# EAGLE board Avalon (EAGLE 5.12)
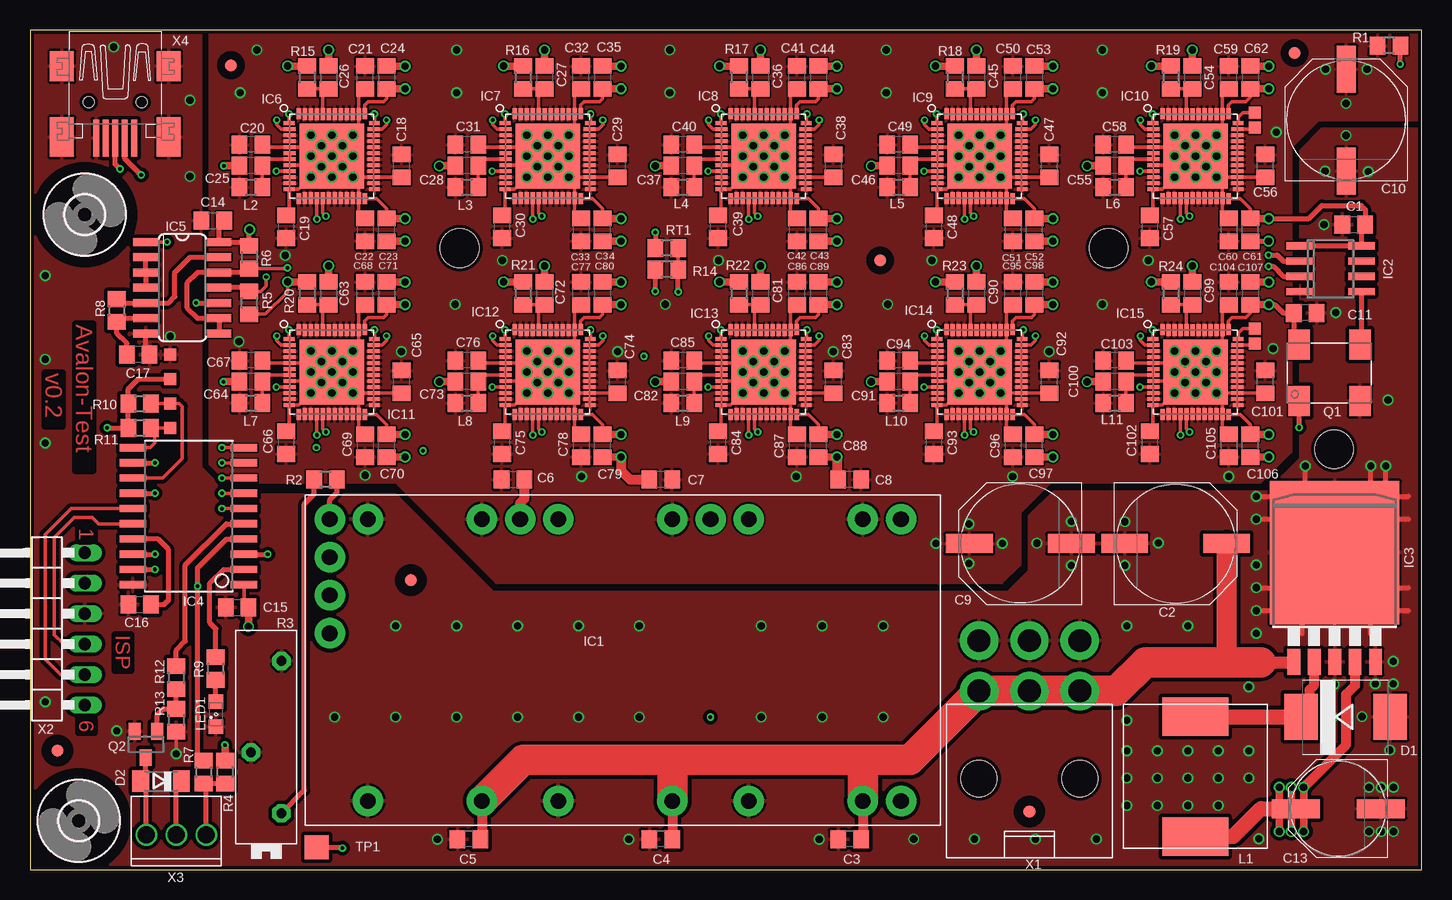
[diagram p2: board, top side]
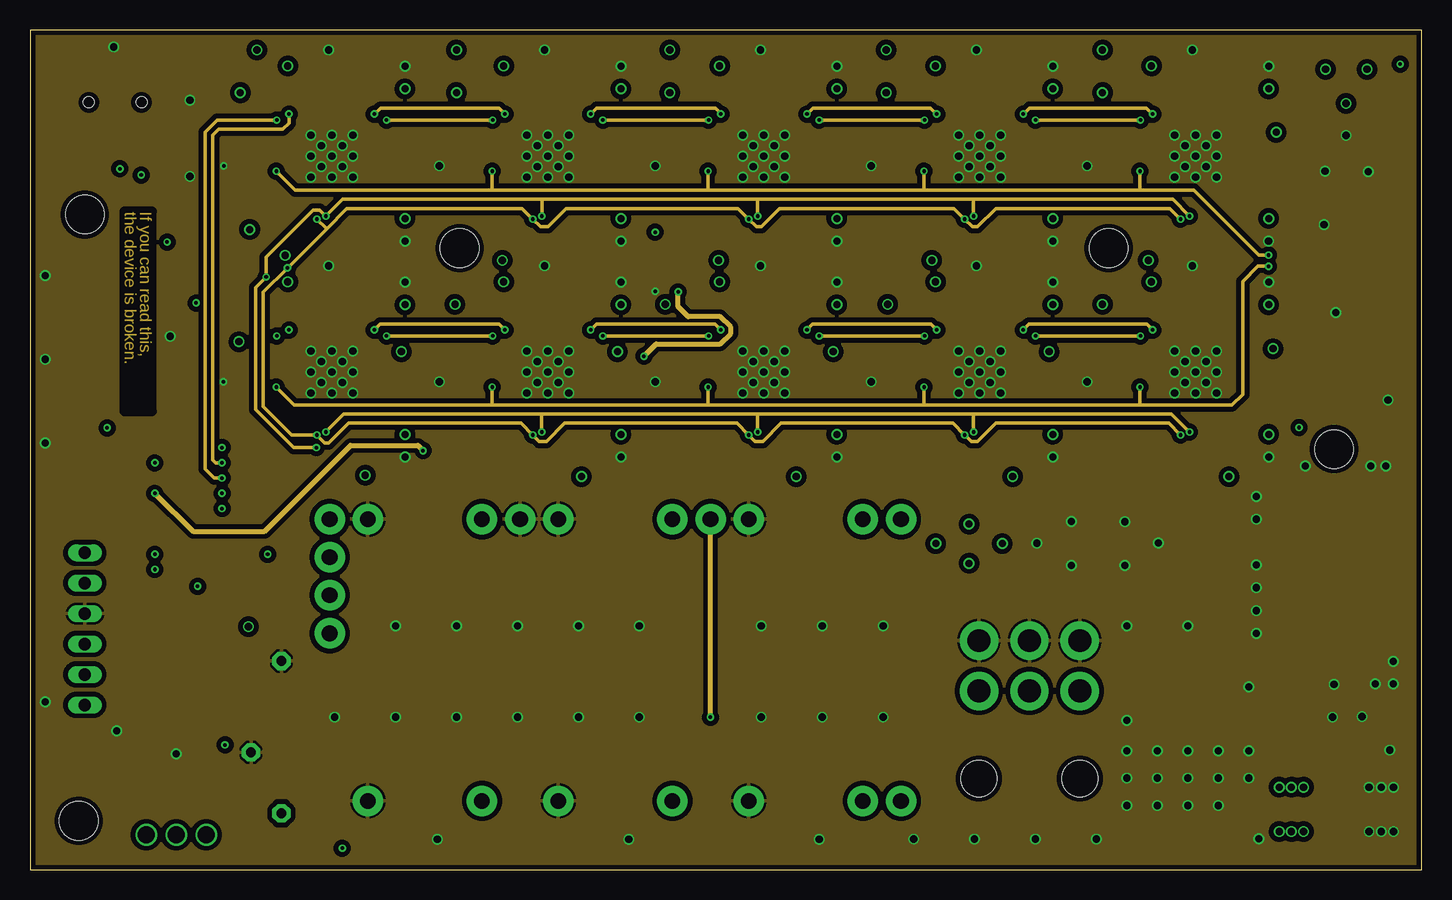
[diagram p3: board, inner layer Route2]
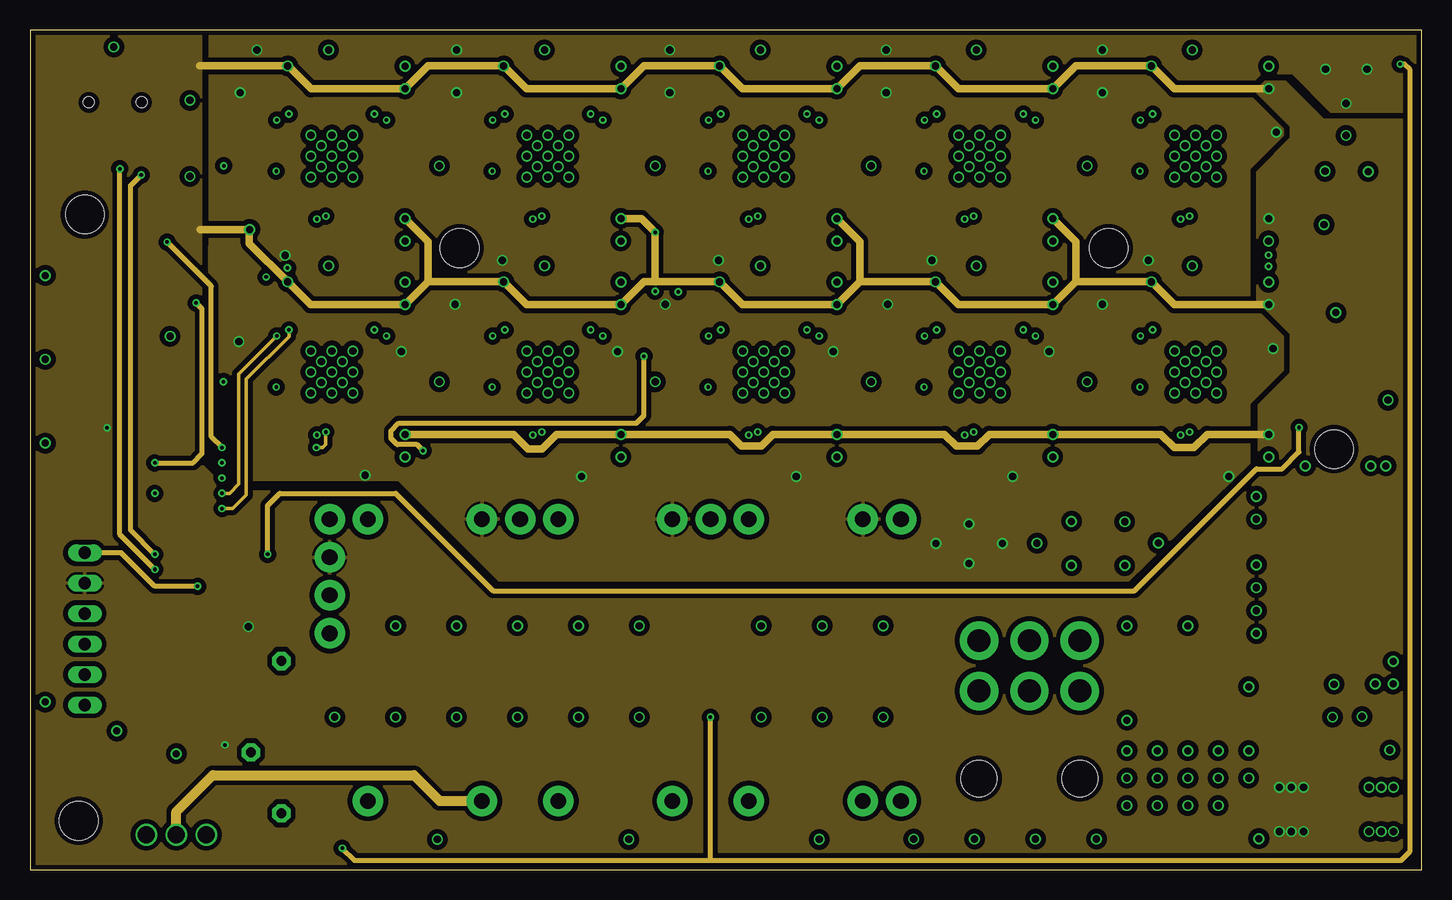
[diagram p4: board, inner layer Route15]
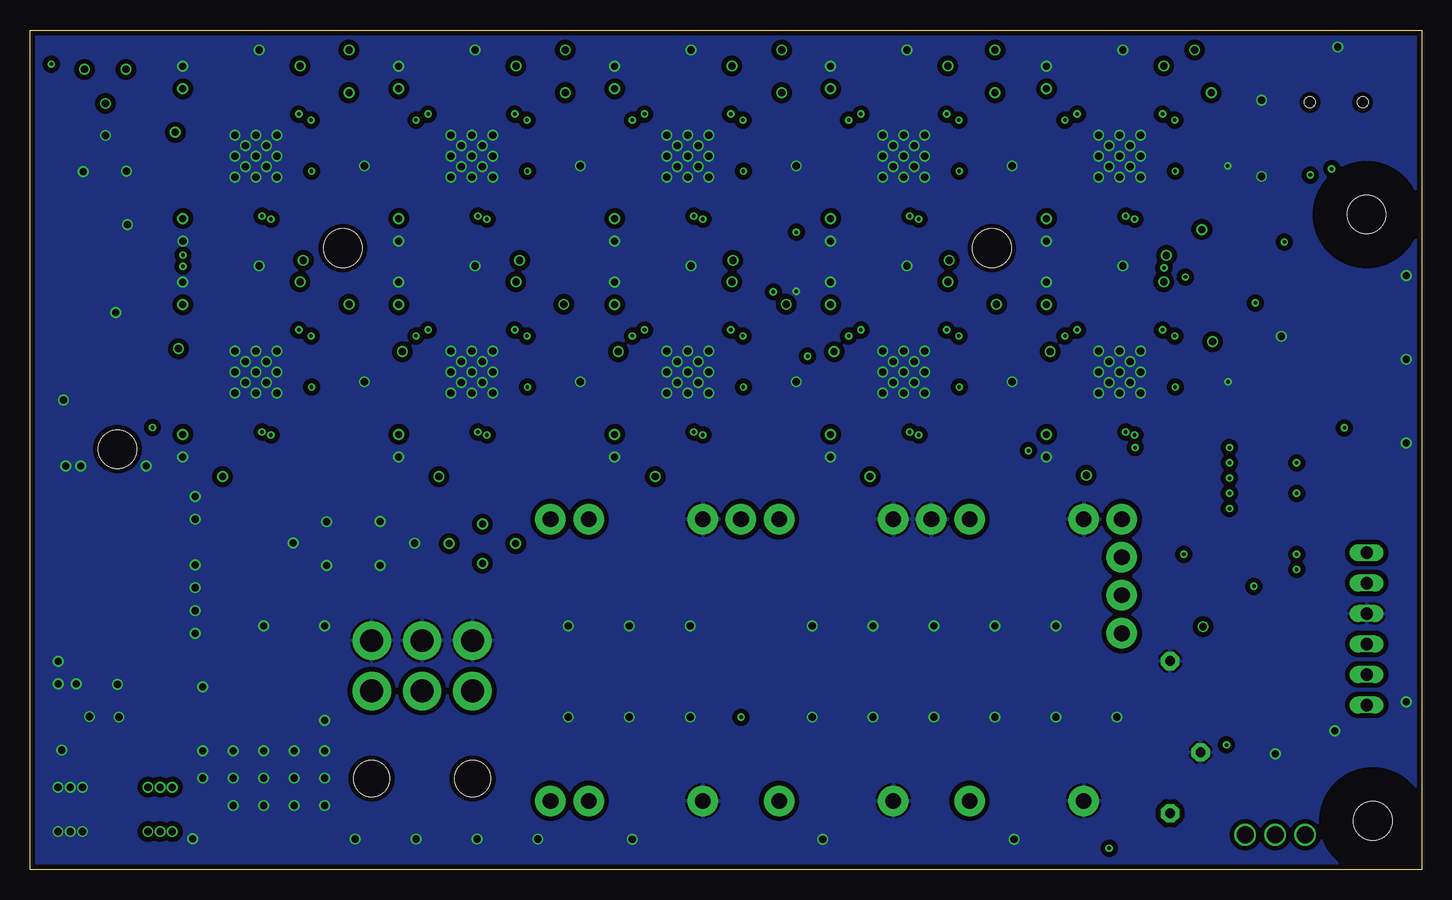
[diagram p5: board, bottom side, seen from below]

Size 116 x 70 mm. Coordinates in mm from the lower left corner, seen from the top.
Outline: 0,0 116,0 116,70 0,70 0,0
Copper layers (1+2*15+16): Top 0.035mm / dielectric 0.38mm / Route2 0.035mm / dielectric 0.71mm / Route15 0.035mm / dielectric 0.38mm / Bottom 0.035mm
Design rules "PCB-POOL Standard_ML4 *": minimum track width 0.15mm, minimum drill 0.3mm, track to track 0.15mm, track to pad 0.15mm, pad to pad 0.15mm, via to via 0.15mm, smd to smd 0.15mm, copper to edge 0.3mm, drill to drill 0.2mm, minimum pad ring 0.2mm, minimum via ring 0.15mm, stop-mask expansion 0.075mm, vias tented up to drill 0mil, thermal gap 0.2mm
Holes 3.2 mm at 35.81,51.82 89.92,51.82 108.71,35.05

## Footprints (pad centres in the part's own frame; a part is rotated, then mirrored left to right if it is on the bottom)
C0805 = smd 1.3 x 1.5: 1 -0.95,0; 2 0.95,0
PANASONIC_G = smd 3.9 x 1.6: + 4.25,0; - -4.25,0
PANASONIC_F = smd 4 x 1.6: + 3.55,0; - -3.55,0
SMC = smd 2.8 x 3.8: A 3.7,0; C -3.7,0
SOD80C = smd 1.4 x 1.8: A 1.7,0; C -1.7,0
FIDUCIAL = smd 1 x 1: 1 0,0
3,2 = hole 3.2: 0,0
PTH12040WAH = drill 1.3 pad 2.54 round: 1 -20.213,-12.377; 2 -10.688,-12.377; 3 -4.338,-12.377; 4 5.187,-12.377; 5 11.537,-12.377; 6 21.062,-12.377; 7 24.237,-12.377; 8 24.237,11.118; 9 21.062,11.118; 10 11.537,11.118; 11 8.362,11.118; 12 5.187,11.118; 13 -4.338,11.118; 14 -7.513,11.118; 15 -10.688,11.118; 16 -20.213,11.118; 17 -23.388,11.118; 18 -23.388,7.943; 19 -23.388,4.768; 20 -23.388,1.593
SO8 = smd 0.6 x 2.2: 1 -1.905,-2.6; 2 -0.635,-2.6; 3 0.635,-2.6; 4 1.905,-2.6; 5 1.905,2.6; 6 0.635,2.6; 7 -0.635,2.6; 8 -1.905,2.6
TO263-5 = smd 1.067 x 2.159: 1 -3.404,-5.791; 2 -1.702,-5.791; 3 0,-5.791; 4 1.702,-5.791; 5 3.404,-5.791 | smd 10.8 x 11.938: 6 0,3.302
SOIC20 = smd 0.61 x 2.21: 1 -5.715,-4.636; 2 -4.445,-4.636; 3 -3.175,-4.636; 4 -1.905,-4.636; 5 -0.635,-4.636; 6 0.635,-4.636; 7 1.905,-4.636; 8 3.175,-4.636; 9 4.445,-4.636; 10 5.715,-4.636; 11 5.715,4.61; 12 4.445,4.636; 13 3.175,4.636; 14 1.905,4.636; 15 0.635,4.636; 16 -0.635,4.636; 17 -1.905,4.636; 18 -3.175,4.636; 19 -4.445,4.636; 20 -5.715,4.636
SO14 = smd 0.66 x 2.032: 1 -3.81,-3.073; 2 -2.54,-3.073; 3 -1.27,-3.073; 4 0,-3.073; 5 1.27,-3.073; 6 2.54,-3.073; 7 3.81,-3.073; 8 3.81,3.073; 9 2.54,3.073; 10 1.27,3.073; 11 0,3.073; 12 -1.27,3.073; 13 -2.54,3.073; 14 -3.81,3.073
QFN48 = smd 0.9 x 0.35: 1 -3.55,2.75; 12 -3.55,-2.75; 25 3.55,-2.75; 36 3.55,2.75 | smd 1 x 0.35: 2 -3.5,2.25; 3 -3.5,1.75; 4 -3.5,1.25; 5 -3.5,0.75; 6 -3.5,0.25; 7 -3.5,-0.25; 8 -3.5,-0.75; 9 -3.5,-1.25; 10 -3.5,-1.75; 11 -3.5,-2.25; 26 3.5,-2.25; 27 3.5,-1.75; 28 3.5,-1.25; 29 3.5,-0.75; 30 3.5,-0.25; 31 3.5,0.25; 32 3.5,0.75; 33 3.5,1.25; 34 3.5,1.75; 35 3.5,2.25 | smd 0.35 x 0.9: 13 -2.75,-3.55; 24 2.75,-3.55; 37 2.75,3.55; 48 -2.75,3.55 | smd 0.35 x 1: 14 -2.25,-3.5; 15 -1.75,-3.5; 16 -1.25,-3.5; 17 -0.75,-3.5; 18 -0.25,-3.5; 19 0.25,-3.5; 20 0.75,-3.5; 21 1.25,-3.5; 22 1.75,-3.5; 23 2.25,-3.5; 38 2.25,3.5; 39 1.75,3.5; 40 1.25,3.5; 41 0.75,3.5; 42 0.25,3.5; 43 -0.25,3.5; 44 -0.75,3.5; 45 -1.25,3.5; 46 -1.75,3.5; 47 -2.25,3.5 | smd 5.4 x 5.4: EXP 0,0
WUERTH-7447709101 = smd 5.5 x 3.2: 1 0,-5; 2 0,5
L0805 = smd 1.3 x 1.5: 1 -0.95,0; 2 0.95,0
SML0805 = smd 1.2 x 1.2: A 1.05,0; C -1.05,0
7W = smd 1.8 x 2.5: 1 -2.54,-2.35; 2 2.54,-2.35; 3 2.54,2.35; 4 -2.54,2.35
SOT23 = smd 1 x 1.4: 1 -0.95,-1.1; 2 0.95,-1.1; 3 0,1.1
R0805 = smd 1.3 x 1.5: 1 -0.95,0; 2 0.95,0
PT-SPIN = drill 0.813 pad 1.524 octagon: 1 -6.35,-1.27; 2 6.35,-1.27; 3 -1.27,1.27
0805 = smd 1.3 x 1.5: 1 -0.95,0; 2 0.95,0
TP20SQ = smd 2 x 2: TP 0,0
TP10SQ = smd 1 x 1: TP 0,0
MOLEX-45558-0003 = drill 1.9 pad 3.2 round: 1 4.2,7.3; 2 0,7.3; 3 -4.2,7.3; 4 4.2,11.5; 5 0,11.5; 6 -4.2,11.5 | hole 3: -4.2,0; 4.2,0
1X06/270 = drill 1.016 long: 1 -6.35,0; 2 -3.81,0; 3 -1.27,0; 4 1.27,0; 5 3.81,0; 6 6.35,0
MOLEX-22-04-1031 = drill 1.4 round: 1 2.5,3.2; 2 0,3.2; 3 -2.5,3.2
32005-301 = smd 3.1 x 0.5: 1 3,1.6; 2 3,0.8; 3 3,0; 4 3,-0.8; 5 3,-1.6 | smd 2.5 x 2: M1 -3,-4.45; M2 -3,4.45 | smd 3.3 x 2: M3 2.9,4.45; M4 2.9,-4.45 | hole 0.9: 0,2.2; 0,-2.2

## Placement (x,y rotation side)
C1  100n  [C0805]  110.35,53.76 0 top
C2  680µ/16V/EEEFK1C681P  [PANASONIC_G]  95.5,27.18 0 top
C3  1µ  [C0805]  68.33,2.54 180 top
C4  1µ  [C0805]  52.58,2.54 180 top
C5  1µ  [C0805]  36.58,2.54 180 top
C6  10µ  [C0805]  40.26,32.51 0 top
C7  10µ  [C0805]  52.58,32.51 180 top
C8  10µ  [C0805]  68.33,32.51 180 top
C9  680µ/16V/EEEFK1C681P  [PANASONIC_G]  82.55,27.18 180 top
C10  680µ/16V/EEEFK1C681P  [PANASONIC_G]  109.73,62.48 90 top
C11  100n  [C0805]  106.3,46.41 180 top
C13  1000µ/6.3V/EEEFP0J102AP  [PANASONIC_F]  109.06,5.07 180 top
C14  100n  [C0805]  15.24,54.1 0 top
C15  100n  [C0805]  17.27,21.84 0 top
C16  100n  [C0805]  9.14,22.1 0 top
C17  470p  [C0805]  9.02,42.93 180 top
C18  1µ  [C0805]  30.99,58.67 90 top
C19  1µ  [C0805]  21.34,53.59 270 top
C20  1µ  [C0805]  18.41,60.45 180 top
C21  1µ  [C0805]  27.94,66.04 90 top
C22  1µ  [C0805]  27.94,53.34 270 top
C23  1µ  [C0805]  29.72,53.34 90 top
C24  1µ  [C0805]  29.72,66.04 270 top
C25  1µ  [C0805]  18.41,58.67 180 top
C26  1µ  [C0805]  24.89,66.04 270 top
C27  1µ  [C0805]  42.89,66.04 270 top
C28  1µ  [C0805]  36.41,58.67 180 top
C29  1µ  [C0805]  48.99,58.67 90 top
C30  1µ  [C0805]  39.34,53.59 270 top
C31  1µ  [C0805]  36.41,60.45 180 top
C32  1µ  [C0805]  45.94,66.04 90 top
C33  1µ  [C0805]  45.94,53.34 270 top
C34  1µ  [C0805]  47.72,53.34 90 top
C35  1µ  [C0805]  47.72,66.04 270 top
C36  1µ  [C0805]  60.89,66.04 270 top
C37  1µ  [C0805]  54.41,58.67 180 top
C38  1µ  [C0805]  66.99,58.67 90 top
C39  1µ  [C0805]  57.34,53.59 270 top
C40  1µ  [C0805]  54.41,60.45 180 top
C41  1µ  [C0805]  63.94,66.04 90 top
C42  1µ  [C0805]  63.94,53.34 270 top
C43  1µ  [C0805]  65.72,53.34 90 top
C44  1µ  [C0805]  65.72,66.04 270 top
C45  1µ  [C0805]  78.89,66.04 270 top
C46  1µ  [C0805]  72.42,58.67 180 top
C47  1µ  [C0805]  84.99,58.67 90 top
C48  1µ  [C0805]  75.34,53.59 270 top
C49  1µ  [C0805]  72.42,60.45 180 top
C50  1µ  [C0805]  81.94,66.04 90 top
C51  1µ  [C0805]  81.94,53.34 270 top
C52  1µ  [C0805]  83.72,53.34 90 top
C53  1µ  [C0805]  83.72,66.04 270 top
C54  1µ  [C0805]  96.89,66.04 270 top
C55  1µ  [C0805]  90.42,58.67 180 top
C56  1µ  [C0805]  102.99,58.67 90 top
C57  1µ  [C0805]  93.34,53.59 270 top
C58  1µ  [C0805]  90.42,60.45 180 top
C59  1µ  [C0805]  99.94,66.04 90 top
C60  1µ  [C0805]  99.94,53.34 270 top
C61  1µ  [C0805]  101.72,53.34 90 top
C62  1µ  [C0805]  101.72,66.04 270 top
C63  1µ  [C0805]  24.89,48.04 270 top
C64  1µ  [C0805]  18.41,40.67 180 top
C65  1µ  [C0805]  30.99,40.67 90 top
C66  1µ  [C0805]  21.34,35.59 270 top
C67  1µ  [C0805]  18.41,42.45 180 top
C68  1µ  [C0805]  27.94,48.04 90 top
C69  1µ  [C0805]  27.94,35.34 270 top
C70  1µ  [C0805]  29.72,35.34 90 top
C71  1µ  [C0805]  29.72,48.04 270 top
C72  1µ  [C0805]  42.89,48.04 270 top
C73  1µ  [C0805]  36.41,40.67 180 top
C74  1µ  [C0805]  48.99,40.67 90 top
C75  1µ  [C0805]  39.34,35.59 270 top
C76  1µ  [C0805]  36.41,42.45 180 top
C77  1µ  [C0805]  45.94,48.04 90 top
C78  1µ  [C0805]  45.94,35.34 270 top
C79  1µ  [C0805]  47.72,35.34 90 top
C80  1µ  [C0805]  47.72,48.04 270 top
C81  1µ  [C0805]  60.89,48.04 270 top
C82  1µ  [C0805]  54.41,40.67 180 top
C83  1µ  [C0805]  66.99,40.67 90 top
C84  1µ  [C0805]  57.34,35.59 270 top
C85  1µ  [C0805]  54.41,42.45 180 top
C86  1µ  [C0805]  63.94,48.04 90 top
C87  1µ  [C0805]  63.94,35.34 270 top
C88  1µ  [C0805]  65.72,35.34 90 top
C89  1µ  [C0805]  65.72,48.04 270 top
C90  1µ  [C0805]  78.89,48.04 270 top
C91  1µ  [C0805]  72.42,40.67 180 top
C92  1µ  [C0805]  84.99,40.67 90 top
C93  1µ  [C0805]  75.34,35.59 270 top
C94  1µ  [C0805]  72.42,42.45 180 top
C95  1µ  [C0805]  81.94,48.04 90 top
C96  1µ  [C0805]  81.94,35.34 270 top
C97  1µ  [C0805]  83.72,35.34 90 top
C98  1µ  [C0805]  83.72,48.04 270 top
C99  1µ  [C0805]  96.89,48.04 270 top
C100  1µ  [C0805]  90.42,40.67 180 top
C101  1µ  [C0805]  102.99,40.67 90 top
C102  1µ  [C0805]  93.34,35.59 270 top
C103  1µ  [C0805]  90.42,42.45 180 top
C104  1µ  [C0805]  99.94,48.04 90 top
C105  1µ  [C0805]  99.94,35.34 270 top
C106  1µ  [C0805]  101.72,35.34 90 top
C107  1µ  [C0805]  101.72,48.04 270 top
D1  MBRS340T3G  [SMC]  109.67,12.73 0 top
D2  4448  [SOD80C]  10.92,7.37 180 top
FID1  1mm  [FIDUCIAL]  2.29,9.91 0 top
FID2  1mm  [FIDUCIAL]  83.31,4.83 0 top
FID3  1mm  [FIDUCIAL]  16.76,67.06 0 top
FID4  1mm  [FIDUCIAL]  105.41,68.07 0 top
FID5  1mm  [FIDUCIAL]  70.87,50.8 0 top
FID6  1mm  [FIDUCIAL]  31.75,24.13 0 top
H1  MOUNT-HOLE3.2  [3,2]  4.57,54.61 0 top
H2  MOUNT-HOLE3.2  [3,2]  4.06,4.06 0 top
IC1  PTH12040WAH  [PTH12040WAH]  48.37,18.1 0 top
IC2  NB3L553DG  [SO8]  108.41,50.09 270 top
IC3  LM2576S-3.3  [TO263-5]  108.76,23.12 0 top
IC4  PIC16LF1459  [SOIC20]  13.21,29.46 90 top
IC5  74HC02D  [SO14]  12.7,48.51 270 top
IC6  A3255Q48  [QFN48]  25.16,59.48 0 top
IC7  A3255Q48  [QFN48]  43.16,59.48 0 top
IC8  A3255Q48  [QFN48]  61.16,59.48 0 top
IC9  A3255Q48  [QFN48]  79.16,59.48 0 top
IC10  A3255Q48  [QFN48]  97.16,59.48 0 top
IC11  A3255Q48  [QFN48]  25.16,41.48 0 top
IC12  A3255Q48  [QFN48]  43.16,41.48 0 top
IC13  A3255Q48  [QFN48]  61.16,41.48 0 top
IC14  A3255Q48  [QFN48]  79.16,41.48 0 top
IC15  A3255Q48  [QFN48]  97.16,41.48 0 top
L1  100µ / Würth 7447709101  [WUERTH-7447709101]  97.13,7.76 180 top
L2  100µ  [L0805]  18.41,56.9 0 top
L3  100µ  [L0805]  36.41,56.9 0 top
L4  100µ  [L0805]  54.41,56.9 0 top
L5  100µ  [L0805]  72.42,56.9 0 top
L6  100µ  [L0805]  90.42,56.9 0 top
L7  100µ  [L0805]  18.41,38.9 0 top
L8  100µ  [L0805]  36.41,38.9 0 top
L9  100µ  [L0805]  54.41,38.9 0 top
L10  100µ  [L0805]  72.42,38.9 0 top
L11  100µ  [L0805]  90.42,38.9 0 top
LED1  green  [SML0805]  15.49,12.95 90 top
Q1  7W-25-000MBB-T  [7W]  108.33,41.41 0 top
Q2  IRFML8244TRPBF  [SOT23]  9.67,10.43 180 top
R1  0R  [R0805]  113.28,68.71 180 top
R2  15k  [R0805]  24.64,32.51 180 top
R3  100k  [PT-SPIN]  19.69,11.04 90 top
R4  10k  [R0805]  16.26,8.13 270 top
R5  390  [R0805]  18.29,47.24 90 top
R6  390  [R0805]  18.29,51.05 270 top
R7  100  [R0805]  14.48,8.13 270 top
R8  100  [R0805]  7.24,46.61 270 top
R9  100  [R0805]  15.49,16.76 90 top
R10  10k  [R0805]  9.14,38.86 0 top
R11  10k  [R0805]  9.14,36.83 0 top
R12  100  [R0805]  12.19,16 270 top
R13  10k  [R0805]  12.19,12.45 270 top
R14  1k  [R0805]  53.09,50.04 180 top
R15  100k  [R0805]  23.11,66.04 270 top
R16  100k  [R0805]  41.11,66.04 270 top
R17  100k  [R0805]  59.11,66.04 270 top
R18  100k  [R0805]  77.11,66.04 270 top
R19  100k  [R0805]  95.11,66.04 270 top
R20  100k  [R0805]  23.11,48.04 270 top
R21  100k  [R0805]  41.11,48.04 270 top
R22  100k  [R0805]  59.11,48.04 270 top
R23  100k  [R0805]  77.11,48.04 270 top
R24  100k  [R0805]  95.11,48.04 270 top
RT1  2k2  [0805]  53.09,51.82 180 top
TP1  TPSQTP20SQ  [TP20SQ]  23.9,1.84 0 top
TP2  TPSQTP10SQ  [TP10SQ]  102.11,63.12 0 top
TP3  TPSQTP10SQ  [TP10SQ]  102.11,61.85 0 top
TP4  TPSQTP10SQ  [TP10SQ]  102.11,45.12 0 top
TP5  TPSQTP10SQ  [TP10SQ]  102.11,43.85 0 top
TP6  TPSQTP10SQ  [TP10SQ]  11.68,40.89 90 top
TP7  TPSQTP10SQ  [TP10SQ]  11.68,36.83 90 top
TP8  TPSQTP10SQ  [TP10SQ]  11.68,38.86 90 top
TP9  TPSQTP10SQ  [TP10SQ]  11.68,42.93 90 top
X1  Molex 45558-0003  [MOLEX-45558-0003]  83.31,7.59 0 top
X2  ISP  [1X06/270]  4.57,20.07 270 top
X3  Molex 22-04-1031  [MOLEX-22-04-1031]  12.19,6.1 180 top
X4  Würth 65100516121 / TE 1734035-2  [32005-301]  7.1,63.98 270 top

## Tracks (layer width: path | path; a pad name or v marks a point on that pad's centre or on a via)
!MCLR  (via drill 0.3)
  Top 0.406: IC4.4 16.38,27.56 13.97,25.15 v13.97,23.62 13.97,9.33 14.22,9.33 R7.1
  Route15 0.406: X2.1 7.62,26.42 10.41,23.62 v13.97,23.62
!RESET1
  Top 0.305: R15.2 C26.2 24.41,64.61 IC6.44
!RESET2
  Top 0.305: R16.2 C27.2 42.41,64.61 IC7.44
!RESET3
  Top 0.305: R17.2 C36.2 60.41,64.61 IC8.44
!RESET4
  Top 0.305: R18.2 C45.2 78.41,64.61 IC9.44
!RESET5
  Top 0.305: R19.2 C54.2 96.41,64.61 IC10.44
!RESET6
  Top 0.305: R20.2 C63.2 24.41,46.61 IC11.44
!RESET7
  Top 0.305: R21.2 C72.2 42.41,46.61 IC12.44
!RESET8
  Top 0.305: R22.2 C81.2 60.41,46.61 IC13.44
!RESET9
  Top 0.305: R23.2 C90.2 78.41,46.61 IC14.44
!RESET10
  Top 0.305: R24.2 C99.2 96.41,46.61 IC15.44
+3V3  (via drill 0.3, 0.6)
  Top 0.305: IC6.37 27.91,63.72 28.19,64.01 29.46,64.01 29.72,64.26 C24.2 | IC6.24 28.91,55.93 29.72,55.12 C23.2 | IC7.37 45.91,63.72 46.19,64.01 47.46,64.01 47.72,64.26 C35.2 | IC7.24 46.91,55.93 47.72,55.12 C34.2 | IC8.37 63.91,63.72 64.19,64.01 65.46,64.01 65.72,64.26 C44.2 | IC8.24 64.91,55.93 65.72,55.12 C43.2 | IC9.37 81.91,63.72 82.19,64.01 83.46,64.01 83.72,64.26 C53.2 | IC9.24 82.91,55.93 83.72,55.12 C52.2 | IC10.37 99.91,63.72 100.19,64.01 101.34,64.01 101.72,64.39 C62.2 | IC10.24 100.91,55.93 101.72,55.12 C61.2 | IC11.37 27.91,45.72 28.19,46.01 29.46,46.01 29.72,46.26 C71.2 | IC11.24 28.91,37.93 29.72,37.12 C70.2 | IC12.37 45.91,45.72 46.19,46.01 47.46,46.01 47.72,46.26 C80.2 | IC12.24 46.91,37.93 47.72,37.12 C79.2 | IC13.37 63.91,45.72 64.19,46.01 65.46,46.01 65.72,46.26 C89.2 | IC13.24 64.91,37.93 65.72,37.12 C88.2 | IC14.37 81.91,45.72 82.19,46.01 83.46,46.01 83.72,46.26 C98.2 | IC14.24 82.91,37.93 83.72,37.12 C97.2 | IC15.37 99.91,45.72 100.19,46.01 101.34,46.01 101.72,46.39 C107.2 | IC15.24 100.91,37.93 101.72,37.12 C106.2 | IC4.1 17.84,22.22 C15.2 | R5.1 19.62,46.29 21.49,48.16 v21.49,49.01
  Top 0.406: C14.2 15.77,53.69 IC5.14 17.97,52.32 R6.1 18.29,53.34 v18.31,53.37 | IC2.1 IC2.8 111,51.99 111,53.85 111.3,53.85 C1.2 111.3,55.07 111,55.37 107.7,55.37 106.6,54.28 v103.27,54.28 | Q1.4 105.35,44.2 C11.2 104.46,46.41 103.78,47.1 v103.27,47.1 | RT1.2 52.14,53.12 v52.12,53.14 | TP6.TP 9.02,40.89 8.19,40.07 R10.1 R11.1 v6.43,36.83
  Top 0.61: R15.1 21.5,66.99 v21.49,67 | C24.2 31.26,65.09 v31.27,65.1 | C23.2 31.26,54.29 v31.27,54.28 | R16.1 39.5,66.99 v39.49,67 | C35.2 49.26,65.09 v49.27,65.1 | C34.2 49.26,54.29 v49.27,54.28 | R17.1 57.5,66.99 v57.49,67 | C44.2 67.26,65.09 v67.27,65.1 | C43.2 67.26,54.29 v67.27,54.28 | R18.1 75.5,66.99 v75.49,67 | C53.2 85.26,65.09 v85.27,65.1 | C52.2 85.26,54.29 v85.27,54.28 | R19.1 93.5,66.99 v93.49,67 | C62.2 103.26,65.09 v103.27,65.1 | C61.2 103.26,54.29 v103.27,54.28 | R20.1 21.5,48.99 v21.49,49.01 | C71.2 31.26,47.09 v31.27,47.1 | C70.2 31.26,36.29 v31.27,36.28 | R21.1 39.5,48.99 v39.49,49.01 | C80.2 49.26,47.09 v49.27,47.1 | C79.2 49.26,36.29 v49.27,36.28 | R22.1 57.5,48.99 v57.49,49.01 | C89.2 67.26,47.09 v67.27,47.1 | C88.2 67.26,36.29 v67.27,36.28 | R23.1 75.5,48.99 v75.49,49.01 | C98.2 85.26,47.09 v85.27,47.1 | C97.2 85.26,36.29 v85.27,36.28 | R24.1 93.5,48.99 v93.49,49.01 | C107.2 103.26,47.09 v103.27,47.1 | C106.2 103.26,36.29 v103.27,36.28 | C15.2 18.22,20.25 v18.21,20.24 | R4.1 v16.26,10.39 | v106.17,3.17 106.17,5.08 v106.17,6.86 | v104.14,3.17 v104.14,6.86 | v105.16,3.17 105.16,5.08 v105.16,6.86
  Top 0.813: 106.17,5.08 C13.+ | IC3.4 110.46,15.34 109.73,14.61 109.73,10.41 v106.17,6.86
  Top 1.27: 105.16,5.08 105.15,5.07 102.61,5.07 100.3,2.76 L1.2
  Route15 0.61: 69.17,49.01 v67.27,47.1 59.39,47.1 v57.49,49.01 52.12,49.01 | v67.27,54.28 69.17,52.38 69.17,49.01 | v31.27,54.28 33.17,52.38 33.17,49.01 | v103.27,65.1 95.39,65.1 v93.49,67 87.17,67 v85.27,65.1 77.39,65.1 v75.49,67 69.17,67 v67.27,65.1 59.39,65.1 v57.49,67 51.17,67 v49.27,65.1 41.39,65.1 v39.49,67 33.17,67 v31.27,65.1 23.42,65.1 21.46,67.06 | 33.17,49.01 v39.49,49.01 41.39,47.1 v49.27,47.1 51.17,49.01 52.12,49.01 | 69.17,49.01 v75.49,49.01 77.39,47.1 v85.27,47.1 87.17,49.01 | 87.17,49.01 v93.49,49.01 95.39,47.1 v103.27,47.1 | v85.27,54.28 87.17,52.38 87.17,49.01 | v103.27,36.28 98.13,36.28 97.03,35.18 95.38,35.18 94.28,36.28 v85.27,36.28 79.97,36.28 78.99,35.31 77.22,35.31 76.24,36.28 v67.27,36.28 61.93,36.28 60.96,35.31 59.31,35.31 58.34,36.28 v49.27,36.28 43.9,36.28 42.67,35.05 41.53,35.05 40.3,36.28 v31.27,36.28 | 33.17,49.01 v31.27,47.1 23.39,47.1 v21.49,49.01 18.29,52.21 18.29,53.34 | v49.27,54.28 50.98,54.28 v52.12,53.14 52.12,49.01 | v18.31,53.37 14.2,53.37 | 14.15,67 v21.49,67
  pour Route15 (isolate 0.406): 0,70 14.22,70.1 14.22,33.78 16.51,31.5 30.48,31.5 38.61,23.37 92.08,23.37 100.46,31.75 100.58,31.75 102.49,33.66 102.49,38.73 105.16,41.4 105.16,44.7 102.36,47.5 102.36,58.17 105.16,60.96 105.16,61.98 102.36,64.77 102.36,65.02 103,65.66 104.65,65.66 107.82,62.48 115.82,62.48 116,0 0,0
+12V
  Top 0.305: 12.19,6.94 D2.C
  Top 0.406: X3.2 12.19,6.94
  Top 0.813: IC1.2 37.68,2.7 C5.1 | IC1.4 53.56,2.57 C4.1 | IC1.6 69.43,2.7 C3.1
  Top 1.016: IC3.1 105.3,17.27 102.62,17.27 99.82,17.27 99.75,17.34
  Top 1.676: 99.75,17.34 C2.+
  Top 2.54: IC1.2 41.1,9.14 53.59,9.14 | 53.59,9.14 69.34,9.14 | 69.34,9.14 73.37,9.14 X1.3 X1.2 X1.1 90.58,14.89 92.96,17.27 102.62,17.27 | IC1.6 69.43,9.05 69.34,9.14 | IC1.4 53.56,9.11 53.59,9.14
  Route15 0.813: IC1.2 34.16,5.72 32,7.87 15.24,7.87 12.19,4.83 X3.2
CLK1  (via drill 0.3)
  Top 0.305: IC6.9 v20.53,58.23 | v38.53,58.23 IC7.9 | v56.53,58.23 IC8.9 | v74.53,58.23 IC9.9 | v92.53,58.23 IC10.9
  Top 0.406: IC2.2 104.47,50.72 103.96,51.23 v103.25,51.23
  Route2 0.305: 56.54,56.64 74.55,56.64 | 74.55,56.64 92.53,56.64 | 92.53,56.64 97.03,56.64 102.44,51.23 v103.25,51.23 | v92.53,58.23 92.53,56.64 | v74.53,58.23 74.53,56.66 74.55,56.64 | v56.53,58.23 56.53,56.65 56.54,56.64 | 38.53,56.64 22.12,56.64 v20.53,58.23 | 38.53,56.64 56.54,56.64 | v38.53,58.23 38.53,56.64
CLK2  (via drill 0.3)
  Top 0.305: IC11.9 v20.53,40.23 | v38.53,40.23 IC12.9 | v56.53,40.23 IC13.9 | v74.53,40.23 IC14.9 | v92.53,40.23 IC15.9
  Top 0.406: IC2.3 104.47,49.45 103.63,50.29 v103.25,50.29
  Route2 0.305: 56.54,38.73 74.57,38.73 | 74.57,38.73 92.56,38.73 | v103.25,50.29 102.36,50.29 101.09,49.02 101.09,39.62 100.2,38.73 92.56,38.73 | v92.53,40.23 92.53,38.76 92.56,38.73 | v74.53,40.23 74.53,38.78 74.57,38.73 | v56.53,40.23 56.53,38.74 56.54,38.73 | 38.53,38.73 56.54,38.73 | v38.53,40.23 38.53,38.74 38.53,38.73 | 38.53,38.73 22.03,38.73 v20.53,40.23
CONFIG1_1_2_N  (via drill 0.3)
  Top 0.305: IC7.2 38.95,61.73 38.57,62.1 v38.57,62.48 | IC6.35 29.34,61.73 29.72,62.1 v29.72,62.48
  Route2 0.305: v29.72,62.48 v38.57,62.48
CONFIG1_1_2_P  (via drill 0.3)
  Top 0.305: IC7.1 39.61,62.97 v39.59,62.99 | IC6.36 v28.71,62.98 v28.7,62.99
  Route2 0.305: v28.7,62.99 29.21,63.5 39.12,63.5 39.59,63.03 v39.59,62.99
CONFIG1_2_3_N  (via drill 0.3)
  Top 0.305: IC8.2 56.95,61.73 56.57,62.1 v56.57,62.48 | IC7.35 47.38,61.73 47.75,62.1 v47.75,62.48
  Route2 0.305: v47.75,62.48 v56.57,62.48
CONFIG1_2_3_P  (via drill 0.3)
  Top 0.305: IC8.1 57.61,62.97 v57.59,62.99 | IC7.36 46.71,62.97 v46.74,62.99
  Route2 0.305: v46.74,62.99 47.24,63.5 57.15,63.5 57.59,63.06 v57.59,62.99
CONFIG1_3_4_N  (via drill 0.3)
  Top 0.305: IC9.2 74.95,61.73 74.57,62.1 v74.57,62.48 | IC8.35 65.41,61.73 65.79,62.1 v65.79,62.48
  Route2 0.305: v65.79,62.48 v74.57,62.48
CONFIG1_3_4_P  (via drill 0.3)
  Top 0.305: IC9.1 75.61,62.97 v75.59,62.99 | IC8.36 64.71,62.93 v64.77,62.99
  Route2 0.305: v64.77,62.99 65.28,63.5 75.08,63.5 v75.59,62.99
CONFIG1_4_5_N  (via drill 0.3)
  Top 0.305: IC10.2 92.95,61.73 92.57,62.1 v92.57,62.48 | IC9.35 83.44,61.73 83.82,62.1 v83.82,62.48
  Route2 0.305: v83.82,62.48 v92.57,62.48
CONFIG1_4_5_P  (via drill 0.3)
  Top 0.305: IC10.1 93.61,62.97 v93.59,62.99 | IC9.36 82.71,62.9 v82.8,62.99
  Route2 0.305: v82.8,62.99 83.31,63.5 93.08,63.5 v93.59,62.99
CONFIG1_5_N
  Top 0.305: IC10.35 101.99,61.73 TP3.TP
CONFIG1_5_P
  Top 0.305: IC10.36 100.71,62.74 101.09,63.12 TP2.TP
CONFIG1_N  (via drill 0.3)
  Top 0.305: IC6.2 20.95,61.73 20.57,62.1 v20.57,62.48 | v16,32.64 IC4.8
  Route2 0.305: v20.57,62.48 15.62,62.48 14.61,61.47 14.61,33.4 15.37,32.64 v16,32.64
CONFIG1_P  (via drill 0.3)
  Top 0.305: v16,33.91 IC4.9 | IC6.1 21.61,62.97 v21.59,62.99
  Route2 0.305: v21.59,62.99 21.59,62.23 21.08,61.72 15.75,61.72 15.24,61.21 15.24,34.16 15.49,33.91 v16,33.91
CONFIG2_1_2_N  (via drill 0.3)
  Top 0.305: IC12.2 38.95,43.73 38.57,44.1 v38.57,44.48 | IC11.35 29.34,43.73 29.72,44.1 v29.72,44.48
  Route2 0.305: v29.72,44.48 v38.57,44.48
CONFIG2_1_2_P  (via drill 0.3)
  Top 0.305: IC12.1 39.61,44.97 v39.59,44.99 | IC11.36 v28.71,44.98 v28.7,44.99
  Route2 0.305: v28.7,44.99 29.18,45.47 39.12,45.47 v39.59,44.99
CONFIG2_2_3_N  (via drill 0.3)
  Top 0.305: IC13.2 56.95,43.73 56.57,44.1 v56.57,44.48 | IC12.35 47.38,43.73 47.75,44.1 v47.75,44.48
  Route2 0.305: v47.75,44.48 v56.57,44.48
CONFIG2_2_3_P  (via drill 0.3)
  Top 0.305: IC13.1 57.61,44.97 v57.59,44.99 | IC12.36 46.71,44.97 v46.74,44.99
  Route2 0.305: v46.74,44.99 47.21,45.47 57.12,45.47 v57.59,44.99
CONFIG2_3_4_N  (via drill 0.3)
  Top 0.305: IC14.2 74.95,43.73 74.57,44.1 v74.57,44.48 | IC13.35 65.41,43.73 65.79,44.1 v65.79,44.48
  Route2 0.305: v65.79,44.48 v74.57,44.48
CONFIG2_3_4_P  (via drill 0.3)
  Top 0.305: IC14.1 75.61,44.97 v75.59,44.99 | IC13.36 64.71,44.93 v64.77,44.99
  Route2 0.305: v64.77,44.99 65.24,45.47 75.12,45.47 v75.59,44.99
CONFIG2_4_5_N  (via drill 0.3)
  Top 0.305: IC15.2 92.95,43.73 92.57,44.1 v92.57,44.48 | IC14.35 83.44,43.73 83.82,44.1 v83.82,44.48
  Route2 0.305: v83.82,44.48 v92.57,44.48
CONFIG2_4_5_P  (via drill 0.3)
  Top 0.305: IC15.1 93.61,44.97 v93.59,44.99 | IC14.36 82.71,44.9 v82.8,44.99
  Route2 0.305: v82.8,44.99 83.28,45.47 93.12,45.47 v93.59,44.99
CONFIG2_5_N
  Top 0.305: IC15.35 101.99,43.73 TP5.TP
CONFIG2_5_P
  Top 0.305: IC15.36 100.71,44.74 101.09,45.12 TP4.TP
CONFIG2_N  (via drill 0.3)
  Top 0.305: IC11.2 20.95,43.73 20.57,44.1 v20.57,44.48 | v16,31.37 IC4.7
  Route15 0.305: v20.57,44.48 17.4,41.31 17.4,32.13 16.64,31.37 v16,31.37
CONFIG2_P  (via drill 0.3)
  Top 0.305: v16,30.1 IC4.6 | IC11.1 21.61,44.97 v21.59,44.99
  Route15 0.305: v21.59,44.99 21.59,44.45 18.03,40.89 18.03,31.24 16.89,30.1 v16,30.1
DVDD  (via drill 0.6)
  other vias: 108,66.73 111.46,66.73 109.7,63.88 17.53,64.77 35.56,64.77 53.34,64.77 71.37,64.77 89.41,64.77 39.37,50.8 57.4,50.8 75.18,50.8 93.22,50.8 27.94,32.87 45.97,32.77 63.88,32.77 81.92,32.77 99.95,32.77 18.92,68.33 35.56,68.33 53.34,68.33 71.37,68.33 89.41,68.33 89.41,47.12 71.5,47.12 52.96,47.12 35.43,47.12 17.42,44.02 21.26,51.21 78.28,25.53 81.05,27.18 78.28,28.8 75.51,27.18 84.96,43.18 66.95,43.18 48.97,43.18 30.96,43.18 103.63,43.43 103.89,61.47
  pour Top (isolate 0.152): 14.99,33.78 14.99,70.1 116,70 116,62.48 107.44,62.48 105.16,60.2 105.16,34.8 102.62,32.26 85.09,32.26 82.55,29.72 82.55,25.4 81.03,23.88 38.86,23.88 30.48,32.26 16.51,32.26
  pour Route15 (isolate 0.406): 14.99,34.04 15,70 116,70 116,63.25 108.46,63.25 105.28,66.42 102.62,66.42 101.6,65.41 101.6,64.52 104.39,61.72 104.39,61.21 101.6,58.42 101.6,47.24 104.39,44.45 104.39,41.66 101.6,38.86 101.6,33.91 91.57,24.13 39.12,24.13 30.73,32.51 16.51,32.51
FAN_PWM
  Top 0.406: IC4.5 16.38,28.83 12.95,25.4 12.95,19.05 12.19,18.29 R12.1
GND  (via drill 0.3, 0.6)
  Top 0.305: 23.66,59.48 22.91,60.23 IC6.5 19.59,60.23 C20.1 | IC6.8 22.91,58.73 23.66,59.48 | v26.91,57.73 IC6.27 C18.1 | v26.91,57.73 26.66,57.98 | C19.1 21.61,54.82 IC6.12 22.41,56.73 v23.41,57.73 23.66,57.98 | C21.1 27.41,64.56 IC6.38 27.41,61.73 v26.91,61.23 26.66,60.98 | C22.1 27.41,54.82 IC6.23 27.41,57.23 v26.91,57.73 | 41.66,59.48 40.91,60.23 IC7.5 37.59,60.23 C31.1 | IC7.8 40.91,58.73 41.66,59.48 | v44.91,57.73 IC7.27 C29.1 | v44.91,57.73 44.66,57.98 | C30.1 39.61,54.82 IC7.12 40.41,56.73 v41.41,57.73 41.66,57.98 | C32.1 45.41,64.56 IC7.38 45.41,61.73 v44.91,61.23 44.66,60.98 | C33.1 45.41,54.82 IC7.23 45.41,57.23 v44.91,57.73 | IC8.8 58.91,58.73 59.59,59.41 | 59.59,59.41 59.66,59.48 58.91,60.23 IC8.5 55.59,60.23 C40.1 | v62.91,57.73 IC8.27 C38.1 | v62.91,57.73 62.66,57.98 | C39.1 57.61,54.82 IC8.12 58.41,56.73 v59.41,57.73 59.66,57.98 | C41.1 63.41,64.56 IC8.38 63.41,61.73 v62.91,61.23 62.66,60.98 | C42.1 63.41,54.82 IC8.23 63.41,57.23 v62.91,57.73 | 77.66,59.48 76.91,60.23 IC9.5 73.59,60.23 C49.1 | IC9.8 76.91,58.73 77.66,59.48 | v80.91,57.73 IC9.27 C47.1 | v80.91,57.73 80.66,57.98 | C48.1 75.61,54.82 IC9.12 76.41,56.73 v77.41,57.73 77.66,57.98 | C50.1 81.41,64.56 IC9.38 81.41,61.73 v80.91,61.23 80.66,60.98 | C51.1 81.41,54.82 IC9.23 81.41,57.23 v80.91,57.73 | 95.66,59.48 94.91,60.23 IC10.5 91.59,60.23 C58.1 | IC10.8 94.91,58.73 95.66,59.48 | v98.91,57.73 IC10.27 C56.1 | v98.91,57.73 98.66,57.98 | C57.1 93.61,54.82 IC10.12 94.41,56.73 v95.41,57.73 95.66,57.98 | C59.1 99.41,64.56 IC10.38 99.41,61.73 v98.91,61.23 98.66,60.98 | C60.1 99.41,54.82 IC10.23 99.41,57.23 v98.91,57.73 | 23.66,41.48 22.91,42.23 IC11.5 19.59,42.23 C67.1
  Top 0.305: IC11.8 22.91,40.73 23.66,41.48 | v26.91,39.73 IC11.27 C65.1 | v26.91,39.73 26.66,39.98 | C66.1 21.61,36.82 IC11.12 22.41,38.73 v23.41,39.73 23.66,39.98 | C68.1 27.41,46.56 IC11.38 27.41,43.73 v26.91,43.23 26.66,42.98 | C69.1 27.41,36.82 IC11.23 27.41,39.23 v26.91,39.73 | 41.66,41.48 40.91,42.23 IC12.5 37.59,42.23 C76.1 | IC12.8 40.91,40.73 41.66,41.48 | v44.91,39.73 IC12.27 C74.1 | v44.91,39.73 44.66,39.98 | C75.1 39.61,36.82 IC12.12 40.41,38.73 v41.41,39.73 41.66,39.98 | C77.1 45.41,46.56 IC12.38 45.41,43.73 v44.91,43.23 44.66,42.98 | C78.1 45.41,36.82 IC12.23 45.41,39.23 v44.91,39.73 | 59.66,41.48 58.91,42.23 IC13.5 55.59,42.23 C85.1 | IC13.8 58.91,40.73 59.66,41.48 | v62.91,39.73 IC13.27 C83.1 | v62.91,39.73 62.66,39.98 | C84.1 57.61,36.82 IC13.12 58.41,38.73 v59.41,39.73 59.66,39.98 | C86.1 63.41,46.56 IC13.38 63.41,43.73 v62.91,43.23 62.66,42.98 | C87.1 63.41,36.82 IC13.23 63.41,39.23 v62.91,39.73 | 77.66,41.48 76.91,42.23 IC14.5 73.59,42.23 C94.1 | IC14.8 76.91,40.73 77.66,41.48 | 81.28,39.73 v80.91,39.73 80.66,39.98 | 81.28,39.73 IC14.27 C92.1 | C93.1 75.61,36.82 IC14.12 76.41,38.73 v77.41,39.73 77.66,39.98 | C95.1 81.41,46.56 IC14.38 81.41,43.73 v80.91,43.23 80.66,42.98 | C96.1 81.41,36.82 IC14.23 81.41,39.6 81.28,39.73 | 95.66,41.48 94.91,42.23 IC15.5 91.59,42.23 C103.1 | IC15.8 94.91,40.73 95.66,41.48 | 99.19,39.73 v98.91,39.73 98.66,39.98 | 99.19,39.73 IC15.27 C101.1 | C102.1 93.61,36.82 IC15.12 94.41,38.73 v95.41,39.73 95.66,39.98 | C104.1 99.41,46.56 IC15.38 99.41,43.73 v98.91,43.23 98.66,42.98 | C105.1 99.41,36.82 IC15.23 99.41,39.51 99.19,39.73 | v59.41,59.48 59.52,59.48 59.59,59.41
  Top 0.305: 77.66,59.48 v77.41,59.48 | 95.66,59.48 v95.41,59.48 | 41.66,59.48 v41.41,59.48 | 23.66,59.48 v23.41,59.48 | 23.66,41.48 v23.41,41.48 | 41.66,41.48 v41.41,41.48 | 59.66,41.48 v59.41,41.48 | 77.66,41.48 v77.41,41.48 | 95.66,41.48 v95.41,41.48 | v12.19,9.65 R13.2
  Top 0.406: IC5.7 9.63,43.27 C17.1 | R14.2 52.14,48.22 v52.12,48.21 | C61.1 v103.24,52.39 v103.25,52.4 | v102.23,29.21 104.14,29.21 | v102.23,31.11 104.14,31.11 | v102.23,23.5 104.14,23.5 | v102.23,21.59 104.14,21.59 | 106.32,31.7 106.32,33.68 | 111.76,31.75 v111.76,33.66 | 113.03,31.75 v113.03,33.66 | 113.67,29.21 114.94,29.21 | 113.67,31.11 114.94,31.11 | 113.67,23.5 114.94,23.5 | 113.67,21.59 114.94,21.59 | 111.76,19.68 111.76,20.95 | 106.05,19.68 106.05,20.95
  Top 0.61: C24.1 31.26,66.99 v31.27,66.98 | C26.1 v24.89,68.33 | C25.2 v16.15,58.67 | C23.1 31.26,52.39 v31.27,52.4 | C35.1 49.26,66.99 v49.27,66.98 | C27.1 v42.89,68.33 | C28.2 v34.13,58.67 | C34.1 49.26,52.39 v49.27,52.4 | C44.1 67.26,66.99 v67.27,66.98 | C36.1 v60.89,68.33 | v52.13,58.67 C37.2 | C43.1 67.26,52.39 v67.27,52.4 | C53.1 85.26,66.99 v85.27,66.98 | C45.1 v78.89,68.33 | v70.13,58.67 C46.2 | C52.1 85.26,52.39 v85.27,52.4 | C62.1 103.26,66.99 v103.27,66.98 | C54.1 v96.89,68.33 | v88.13,58.67 C55.2 | C71.1 31.26,48.99 v31.27,48.98 | C63.1 v24.89,50.33 | C64.2 v16.13,40.67 | C70.1 31.26,34.39 v31.27,34.4 | C80.1 49.26,48.99 v49.27,48.98 | C72.1 v42.89,50.33 | C73.2 v34.13,40.67 | C79.1 49.26,34.39 v49.27,34.4 | C89.1 67.26,48.99 v67.27,48.98 | C81.1 v60.89,50.33 | v52.13,40.67 C82.2 | C88.1 67.26,34.39 v67.27,34.4 | C98.1 85.26,48.99 v85.27,48.98 | C90.1 v78.89,50.33 | v70.13,40.67 C91.2 | C97.1 85.26,34.39 v85.27,34.4 | C107.1 103.26,48.99 v103.27,48.98 | C99.1 v96.89,50.33 | v88.13,40.67 C100.2 | C106.1 103.26,34.39 v103.27,34.4
  Top 0.813: C8.2 67.27,32.62 v67.27,34.4 | v49.27,34.4 49.27,33.28 50.04,32.51 C7.2 | C6.2 41.21,30.92 40.86,30.57 IC1.14
  other vias: 25.16,59.48 25.16,61.23 23.41,61.23 26.91,59.48 25.16,57.73 26.04,58.6 24.29,58.6 24.29,60.35 26.04,60.35 43.16,59.48 43.16,61.23 41.41,61.23 44.91,59.48 43.16,57.73 44.03,58.6 42.28,58.6 42.28,60.35 44.03,60.35 61.16,59.48 61.16,61.23 59.41,61.23 62.91,59.48 61.16,57.73 62.03,58.6 60.28,58.6 60.28,60.35 62.03,60.35 79.16,59.48 79.16,61.23 77.41,61.23 80.91,59.48 79.16,57.73 80.03,58.6 78.28,58.6 78.28,60.35 80.03,60.35 97.16,59.48 97.16,61.23 95.41,61.23 98.91,59.48 97.16,57.73 98.03,58.6 96.28,58.6 96.28,60.35 98.03,60.35 25.16,41.48 25.16,43.23 23.41,43.23 26.91,41.48 25.16,39.73 26.04,40.6 24.29,40.6 24.29,42.35 26.04,42.35 43.16,41.48 43.16,43.23 41.41,43.23 44.91,41.48 43.16,39.73 44.03,40.6 42.28,40.6 42.28,42.35 44.03,42.35 61.16,41.48 61.16,43.23 59.41,43.23 62.91,41.48 61.16,39.73 62.03,40.6 60.28,40.6 60.28,42.35 62.03,42.35 79.16,41.48 79.16,43.23 77.41,43.23 80.91,41.48 79.16,39.73 80.03,40.6 78.28,40.6 78.28,42.35 80.03,42.35 97.16,41.48 97.16,43.23 95.41,43.23 98.91,41.48 97.16,39.73 98.03,40.6 96.28,40.6 96.28,42.35 98.03,42.35 112.65,6.86 111.63,6.86 113.67,6.86 112.65,3.17 111.63,3.17 113.67,3.17 107.87,53.77 107.95,58.22 111.56,58.19 109.7,61.21 113.64,17.35 112.14,15.47 113.64,15.47 111.05,12.75 113.36,9.96 102.23,25.4 102.23,19.68 106.32,33.66 86.82,25.35 91.26,25.35 91.26,29.01 86.82,29.03 83.95,27.2 94.06,27.23 13.34,64.14 13.34,57.78 6.99,68.58 1.27,49.53 1.27,42.55 1.27,35.56 1.27,13.97 108.58,12.7 108.71,15.44 113.21,39.14 108.86,46.43 25.4,12.7 30.48,12.7 35.56,12.7 40.64,12.7 45.72,12.7 50.8,12.7 60.96,12.7 66.04,12.7 71.12,12.7 71.12,20.32 66.04,20.32 60.96,20.32 50.8,20.32 45.72,20.32 40.64,20.32 35.56,20.32 30.48,20.32 91.44,20.32 96.52,20.32 33.96,2.51 49.91,2.51 65.79,2.51 73.66,2.54 78.74,2.54 83.82,2.54 88.9,2.54 91.44,5.33 96.52,5.33 96.52,7.62 96.52,9.91 99.06,9.91 101.6,9.91 101.6,7.62 99.06,7.62 99.06,5.33 93.98,5.33 93.98,7.62 93.98,9.91 91.44,9.91 91.44,7.62 91.44,12.45 101.6,15.24 102.44,2.57 11.68,44.45 7.24,11.56
  pour Top (isolate 0.305): 0,70 14.22,70.1 14.22,33.53 16.51,31.24 30.48,31.24 38.61,23.11 81.53,23.11 83.31,24.89 83.31,29.46 85.34,31.5 103.12,31.5 105.92,34.29 105.92,59.94 107.7,61.72 116,61.72 116,0 0,0
  pour Bottom (isolate 0.406): 0,0 0,70 116,70 116,0
  pour Route2 (isolate 0.406): 0,0 0,70 116,70 116,0
ICSPCLK
  Top 0.305: X2.5 2.54,16.26 1.27,17.53 1.27,27.94 3.43,30.1 IC4.15
ICSPDAT
  Top 0.305: X2.4 2.79,18.8 2.03,19.56 2.03,27.69 3.68,29.34 5.21,29.34 5.71,28.83 IC4.16
LED
  Top 0.406: R9.2 15.49,20.07 14.99,20.57 14.99,23.88 16.13,25.02 IC4.2
N$41
  Top 0.406: C16.2 11.18,22.1 11.56,22.48 11.56,26.67 10.67,27.56 IC4.17
N$42
  Top 0.406: IC1.17 24.98,30.82 25.59,31.43 R2.1
N$43
  Top 0.406: R2.2 23.69,31.31 22.86,30.48 22.86,6.59 R3.1
N$44
  Top 0.813: IC3.2 107.06,15.36 106.68,14.99 106.68,13.43 D1.C
  Top 1.016: L1.1 97.63,12.76 97.67,12.73
  Top 1.27: 97.67,12.73 D1.C
N$45
  Top 0.406: IC2.5 111.01,43.9 Q1.3
N$46
  Top 0.305: 9.69,6.9 D2.A 9.67,7.81
  Top 0.406: X3.1 9.69,6.9 | 9.67,7.81 Q2.3
N$47
  Top 0.406: IC5.13 13.34,51.05 12.06,49.78 12.06,47.75 11.56,47.24 IC5.5 7.55,47.24 R8.1
N$48
  Top 0.406: IC5.4 IC5.3 IC5.2
N$49
  Top 0.406: R12.2 R13.1 11.11,13.4 10.62,12.9 Q2.1
N$51
  Top 0.406: IC5.6 7.55,45.97 R8.2 7.24,44.7 8.07,43.88 C17.2
N$55
  Top 0.305: 14.69,6.96 R7.2
  Top 0.406: X3.3 14.69,6.96 | R7.2 R4.2
N$56
  Top 0.406: LED1.A R9.1
NTC  (via drill 0.3)
  Top 0.305: R14.1 RT1.1
  Top 0.406: R14.1 v54.04,48.17 54.03,48.16 | IC4.14 v10.41,31.37
  Route2 0.406: v54.04,48.17 54.04,46.93 54.86,46.1 57.53,46.1 58.42,45.21 58.42,44.7 57.53,43.81 52.2,43.81 v51.18,42.8 | v10.41,31.37 13.59,28.19 19.56,28.19 26.72,35.36 32.33,35.36 v32.77,34.92
  Route15 0.406: v51.18,42.8 51.18,37.85 50.55,37.21 30.73,37.21 30.1,36.58 30.1,35.94 30.61,35.43 32.26,35.43 v32.77,34.92
OSC_EN  (via drill 0.3)
  Top 0.406: Q1.1 v105.79,36.86 v105.79,36.85 | IC4.3 v19.81,26.29
  Route15 0.406: v19.81,26.29 19.81,30.35 20.83,31.37 30.48,31.37 38.61,23.24 92.08,23.24 102.23,33.4 104.39,33.4 105.79,34.8 v105.79,36.85
REPORT_CLK  (via drill 0.3)
  Top 0.305: v16,35.18 IC4.10 | v11.43,52.32 IC5.1
  Route15 0.406: v16,35.18 15.11,36.07 15.11,48.64 v11.43,52.32
REPORT_DATA  (via drill 0.3)
  Top 0.406: v13.84,47.24 IC5.10 | IC4.12 v10.41,33.91
  Route15 0.406: v10.41,33.91 13.59,33.91 14.35,34.67 14.35,46.74 v13.84,47.24
REPORT_N  (via drill 0.3)
  Top 0.305: v23.91,54.23 IC6.16 | v41.91,54.23 IC7.16 | v59.91,54.23 IC8.16 | v77.91,54.23 IC9.16 | v95.91,54.23 IC10.16 | v23.91,36.23 IC11.16 | v41.91,36.23 IC12.16 | v59.91,36.23 IC13.16 | v77.91,36.23 IC14.16 | v95.91,36.23 IC15.16 | v21.46,50.16 21.4,50.1 R6.2 17.97,49.78
  Top 0.406: 17.97,49.78 IC5.12 13.97,49.78 13.08,48.9 13.08,46.86 13.97,45.97 IC5.9 IC5.8
  Route2 0.305: v95.91,54.23 95.02,55.12 80.52,55.12 78.99,53.59 78.54,53.59 v77.91,54.23 77.02,55.12 62.48,55.12 60.96,53.59 60.54,53.59 v59.91,54.23 59.02,55.12 44.7,55.12 43.18,53.59 42.54,53.59 v41.91,54.23 41.02,55.12 26.42,55.12 24.71,53.42 | v95.91,36.23 94.93,37.21 80.52,37.21 78.99,35.69 78.49,35.69 77.94,36.23 v77.91,36.23 76.93,37.21 62.61,37.21 61.09,35.69 60.45,35.69 v59.91,36.23 58.93,37.21 44.58,37.21 43.05,35.69 42.45,35.69 v41.91,36.23 40.93,37.21 26.54,37.21 24.89,35.56 24.58,35.56 v23.91,36.23 21.81,36.23 19.43,38.61 19.43,48.13 v21.46,50.16 24.71,53.42 | v23.91,54.23 24.71,53.42
REPORT_P  (via drill 0.3)
  Top 0.305: IC6.17 24.41,54.73 v24.66,54.48 | IC7.17 42.41,54.73 v42.66,54.48 | IC8.17 60.41,54.73 v60.66,54.48 | IC9.17 78.41,54.73 v78.66,54.48 | IC10.17 96.41,54.73 v96.66,54.48 | IC11.17 24.41,36.73 v24.66,36.48 | IC12.17 42.41,36.73 v42.66,36.48 | IC13.17 60.41,36.73 v60.66,36.48 | IC14.17 78.41,36.73 v78.66,36.48 | IC15.17 96.41,36.73 v96.66,36.48 | R5.2 19.24,48.19 19.68,48.64 v19.68,49.4
  Top 0.406: IC5.11 17.97,48.51 R5.2
  Route2 0.305: 42.67,55.88 26.06,55.88 v24.66,54.48 24.15,54.99 23.62,54.99 19.68,51.05 v19.68,49.4 18.8,48.51 18.8,38.35 21.97,35.18 v23.88,35.18 | 42.67,55.88 60.68,55.88 | 60.68,55.88 78.69,55.88 | v42.66,54.48 42.67,54.49 42.67,55.88 | v60.66,54.48 60.66,55.86 60.68,55.88 | v78.66,54.48 78.66,55.85 78.69,55.88 | v96.66,54.48 95.26,55.88 78.69,55.88 | 42.67,37.97 60.66,37.97 | 60.66,37.97 78.66,37.97 | v42.66,36.48 42.66,37.96 42.67,37.97 | v60.66,36.48 60.66,37.97 | v78.66,36.48 78.66,37.97 | v24.66,36.48 26.16,37.97 42.67,37.97 | v96.66,36.48 95.17,37.97 78.66,37.97
  Route15 0.305: v24.66,36.48 24.64,36.46 24.64,35.43 24.38,35.18 v23.88,35.18
SCL
  Top 0.305: TP7.TP R11.2 10.16,36.83 10.41,36.58 10.41,35.56 10.03,35.18 IC4.11
SDA
  Top 0.305: R10.2 TP8.TP 12.45,38.86 12.7,38.61 12.7,34.29 11.05,32.64 IC4.13
SENSE_VCC_D1  (via drill 0.3)
  Top 0.406: R1.1 114.23,67.17 v114.22,67.16 | TP1.TP 25.97,1.84 v26.04,1.78
  Route2 0.406: v56.72,12.7 56.72,29.2 IC1.11
  Route15 0.406: v114.22,67.16 114.58,67.16 115.06,66.67 115.06,1.52 114.3,0.76 56.72,0.76 | 56.72,0.76 27.05,0.76 v26.04,1.78 | 56.72,0.76 v56.72,12.7
USB_DM  (via drill 0.3)
  Top 0.406: IC4.18 v10.41,26.29 | X4.2 7.9,59.28 v9.27,57.91
  Route15 0.406: v9.27,57.91 8.38,57.02 8.38,28.32 v10.41,26.29
USB_DP  (via drill 0.3)
  Top 0.406: IC4.19 v10.41,25.02 | X4.3 7.1,58.81 v7.49,58.42
  Route15 0.406: v7.49,58.42 7.49,27.94 v10.41,25.02
VDD_PLL1
  Top 0.305: IC6.6 IC6.7 19.92,59.23 C25.1 L2.2
VDD_PLL2
  Top 0.305: IC7.6 IC7.7 37.92,59.23 C28.1 L3.2
VDD_PLL3
  Top 0.305: IC8.6 IC8.7 55.92,59.23 C37.1 L4.2
VDD_PLL4
  Top 0.305: IC9.6 IC9.7 73.92,59.23 C46.1 L5.2
VDD_PLL5
  Top 0.305: IC10.6 IC10.7 91.92,59.23 C55.1 L6.2
VDD_PLL6
  Top 0.305: IC11.6 IC11.7 19.92,41.23 C64.1 L7.2
VDD_PLL7
  Top 0.305: IC12.6 IC12.7 37.92,41.23 C73.1 L8.2
VDD_PLL8
  Top 0.305: IC13.6 IC13.7 55.92,41.23 C82.1 L9.2
VDD_PLL9
  Top 0.305: IC14.6 IC14.7 73.92,41.23 C91.1 L10.2
VDD_PLL10
  Top 0.305: IC15.6 IC15.7 91.92,41.23 C100.1 L11.2

## Text on the board
Top: Avalon-Test | v0.2 | 1 | ISP | 6
Route2: the device is broken. | If you can read this,
tStop: Avalon-Test | v0.2 | 1 | ISP | 6